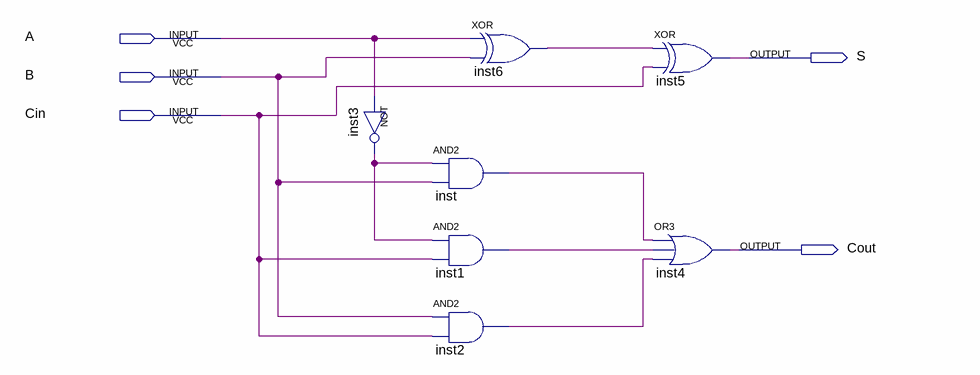
[diagram p0: schematic sheet]
// Quartus schematic subtrator.bdf as structural Verilog: 7 symbols, 5 pins
module subtrator (
  input  A,
  input  B,
  input  Cin,
  output S,
  output Cout
);

  wire inst1_out, inst2_out, inst3_out, inst6_out, inst_out;

  not inst3 (inst3_out, A);
  xor inst6 (inst6_out, A, B);
  and inst (inst_out, inst3_out, B);
  and inst1 (inst1_out, inst3_out, Cin);
  and inst2 (inst2_out, B, Cin);
  xor inst5 (S, inst6_out, Cin);
  or inst4 (Cout, inst_out, inst1_out, inst2_out);
endmodule
